# EAGLE schematic shield (EAGLE 9.3.0)
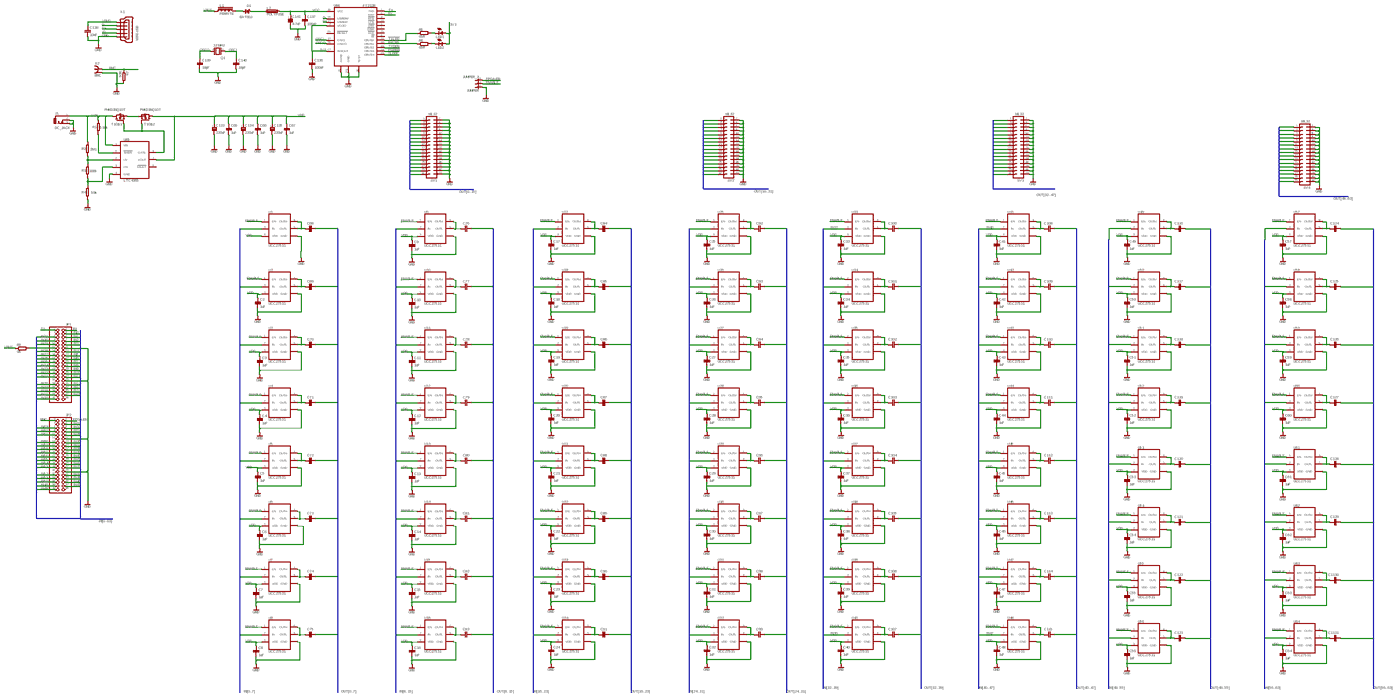
[diagram p0: schematic, sheet 1, overview]
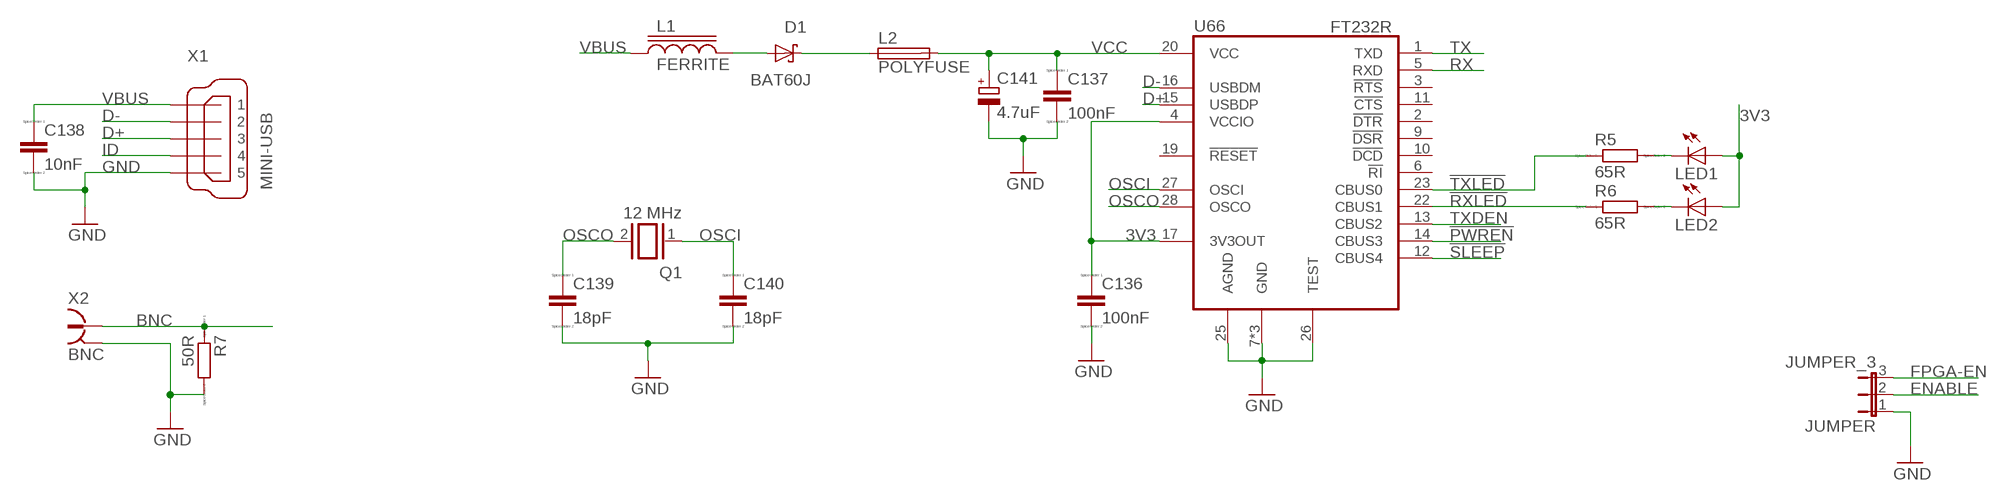
[diagram p1: schematic, sheet 1, part 1 of 4]
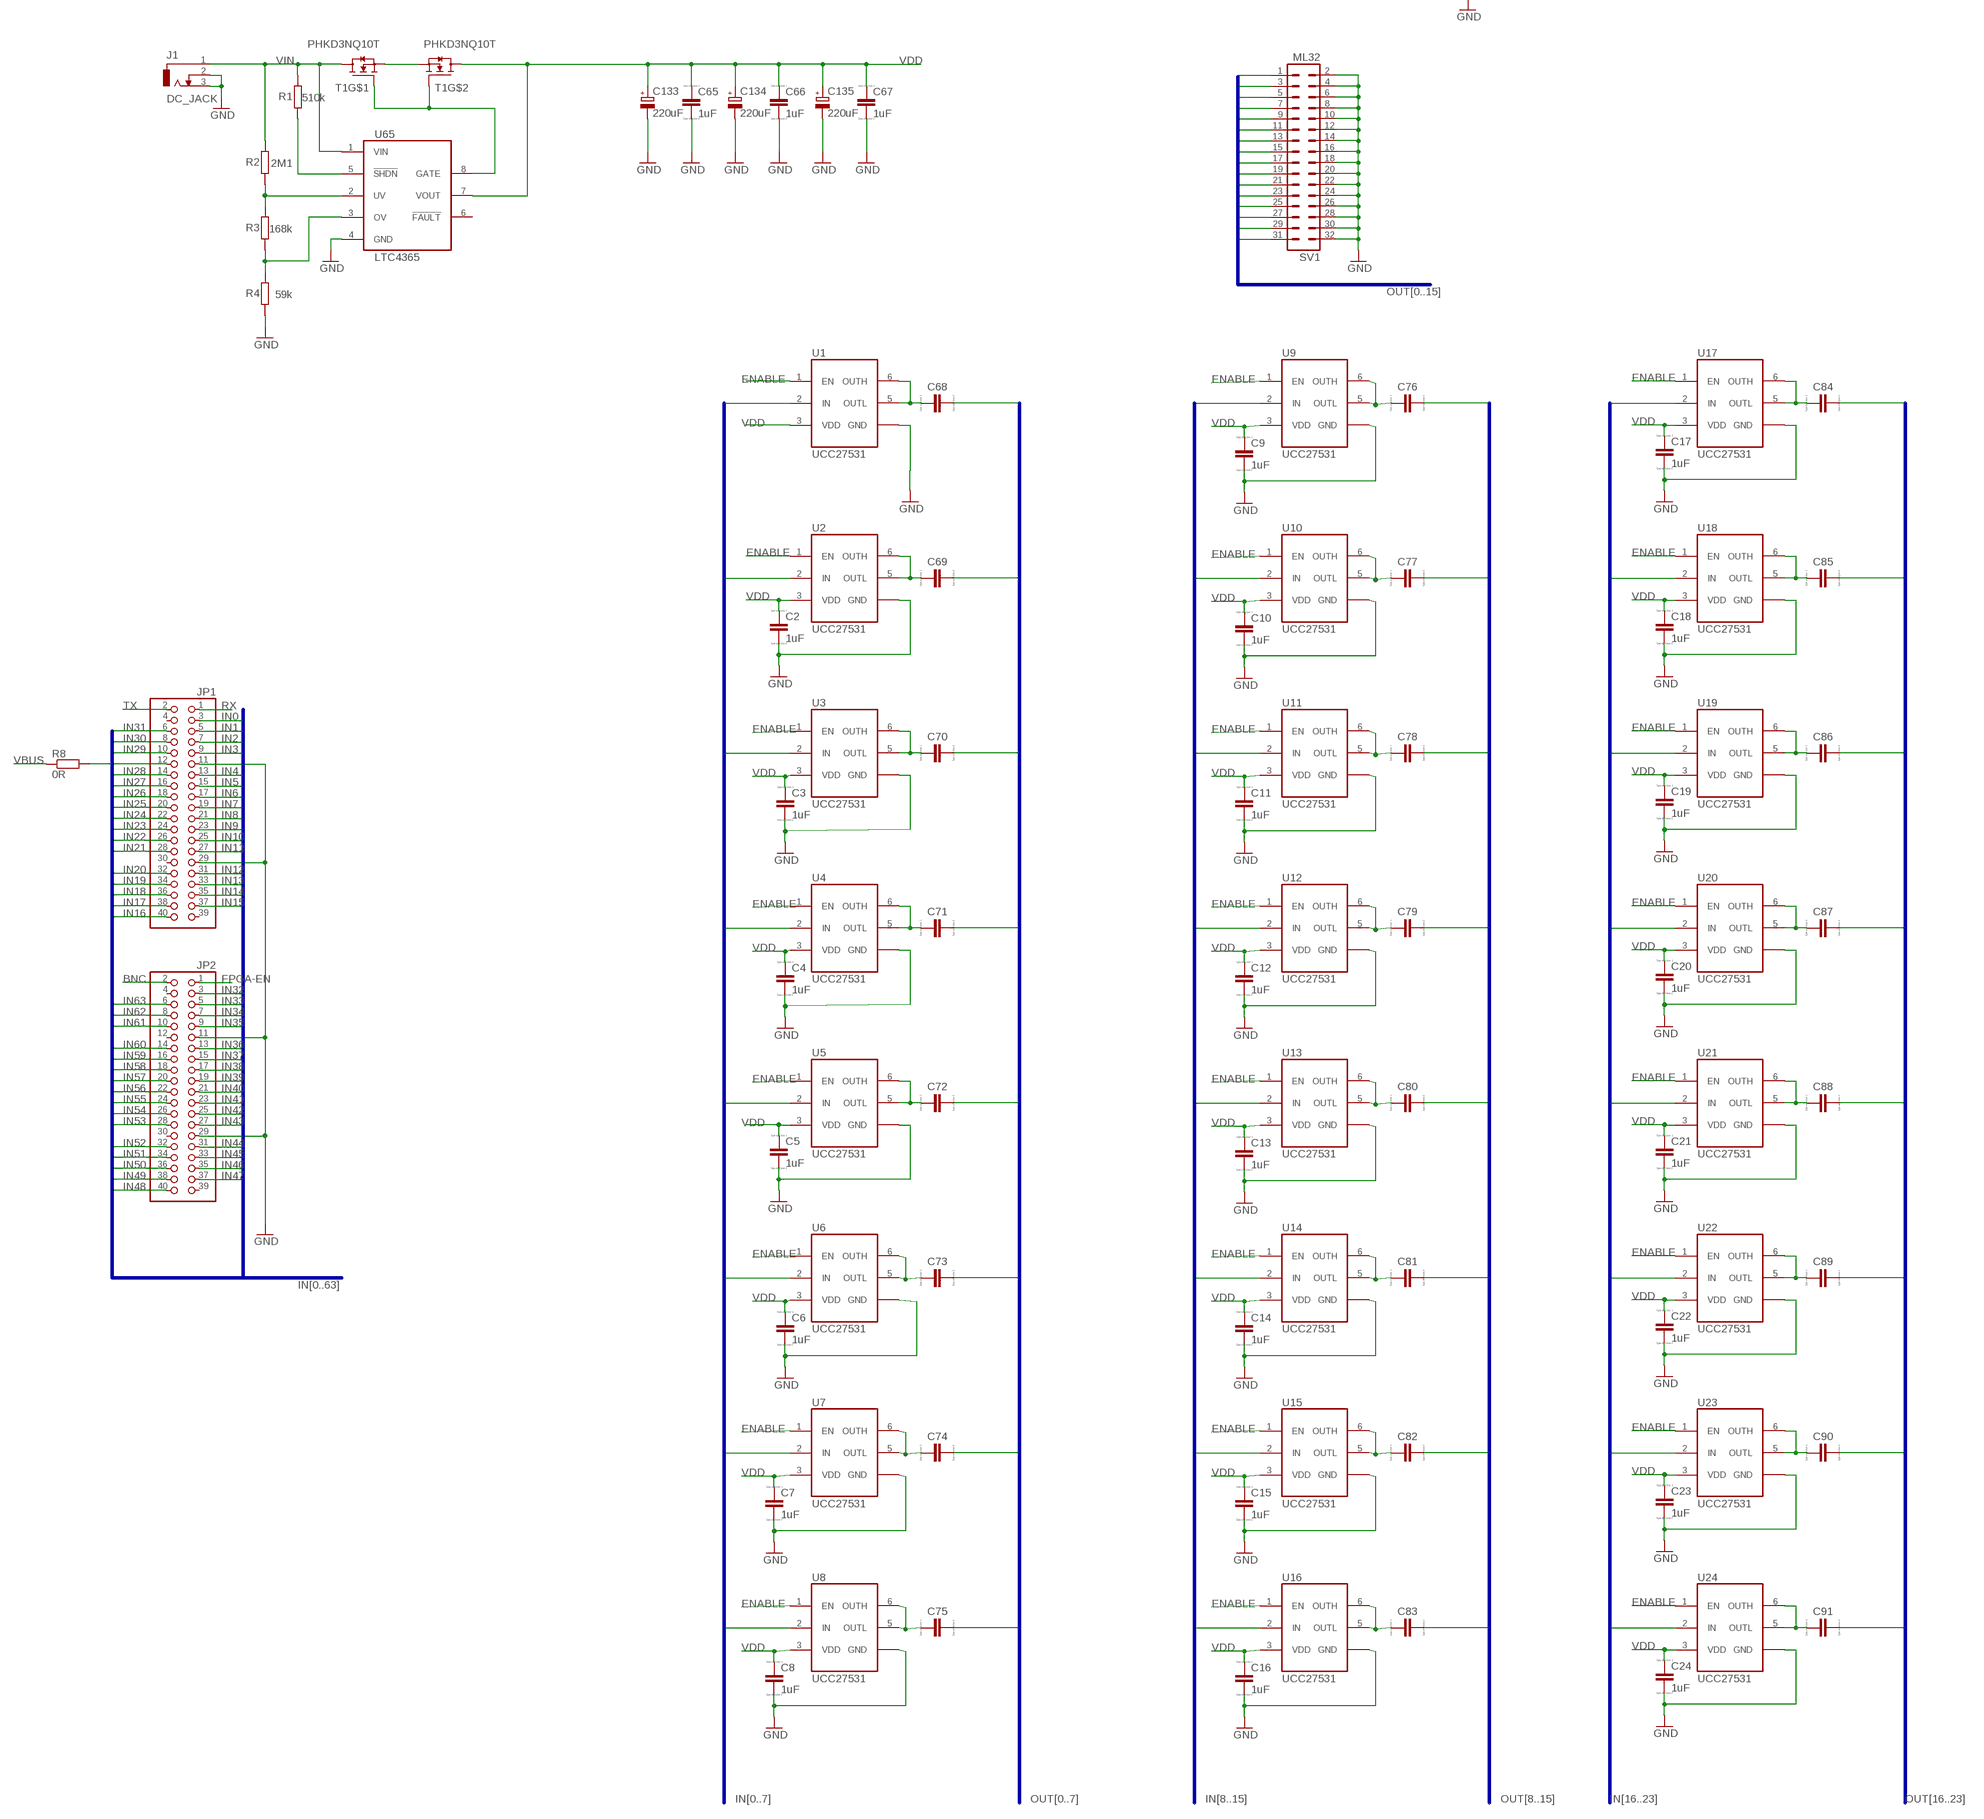
[diagram p2: schematic, sheet 1, part 2 of 4]
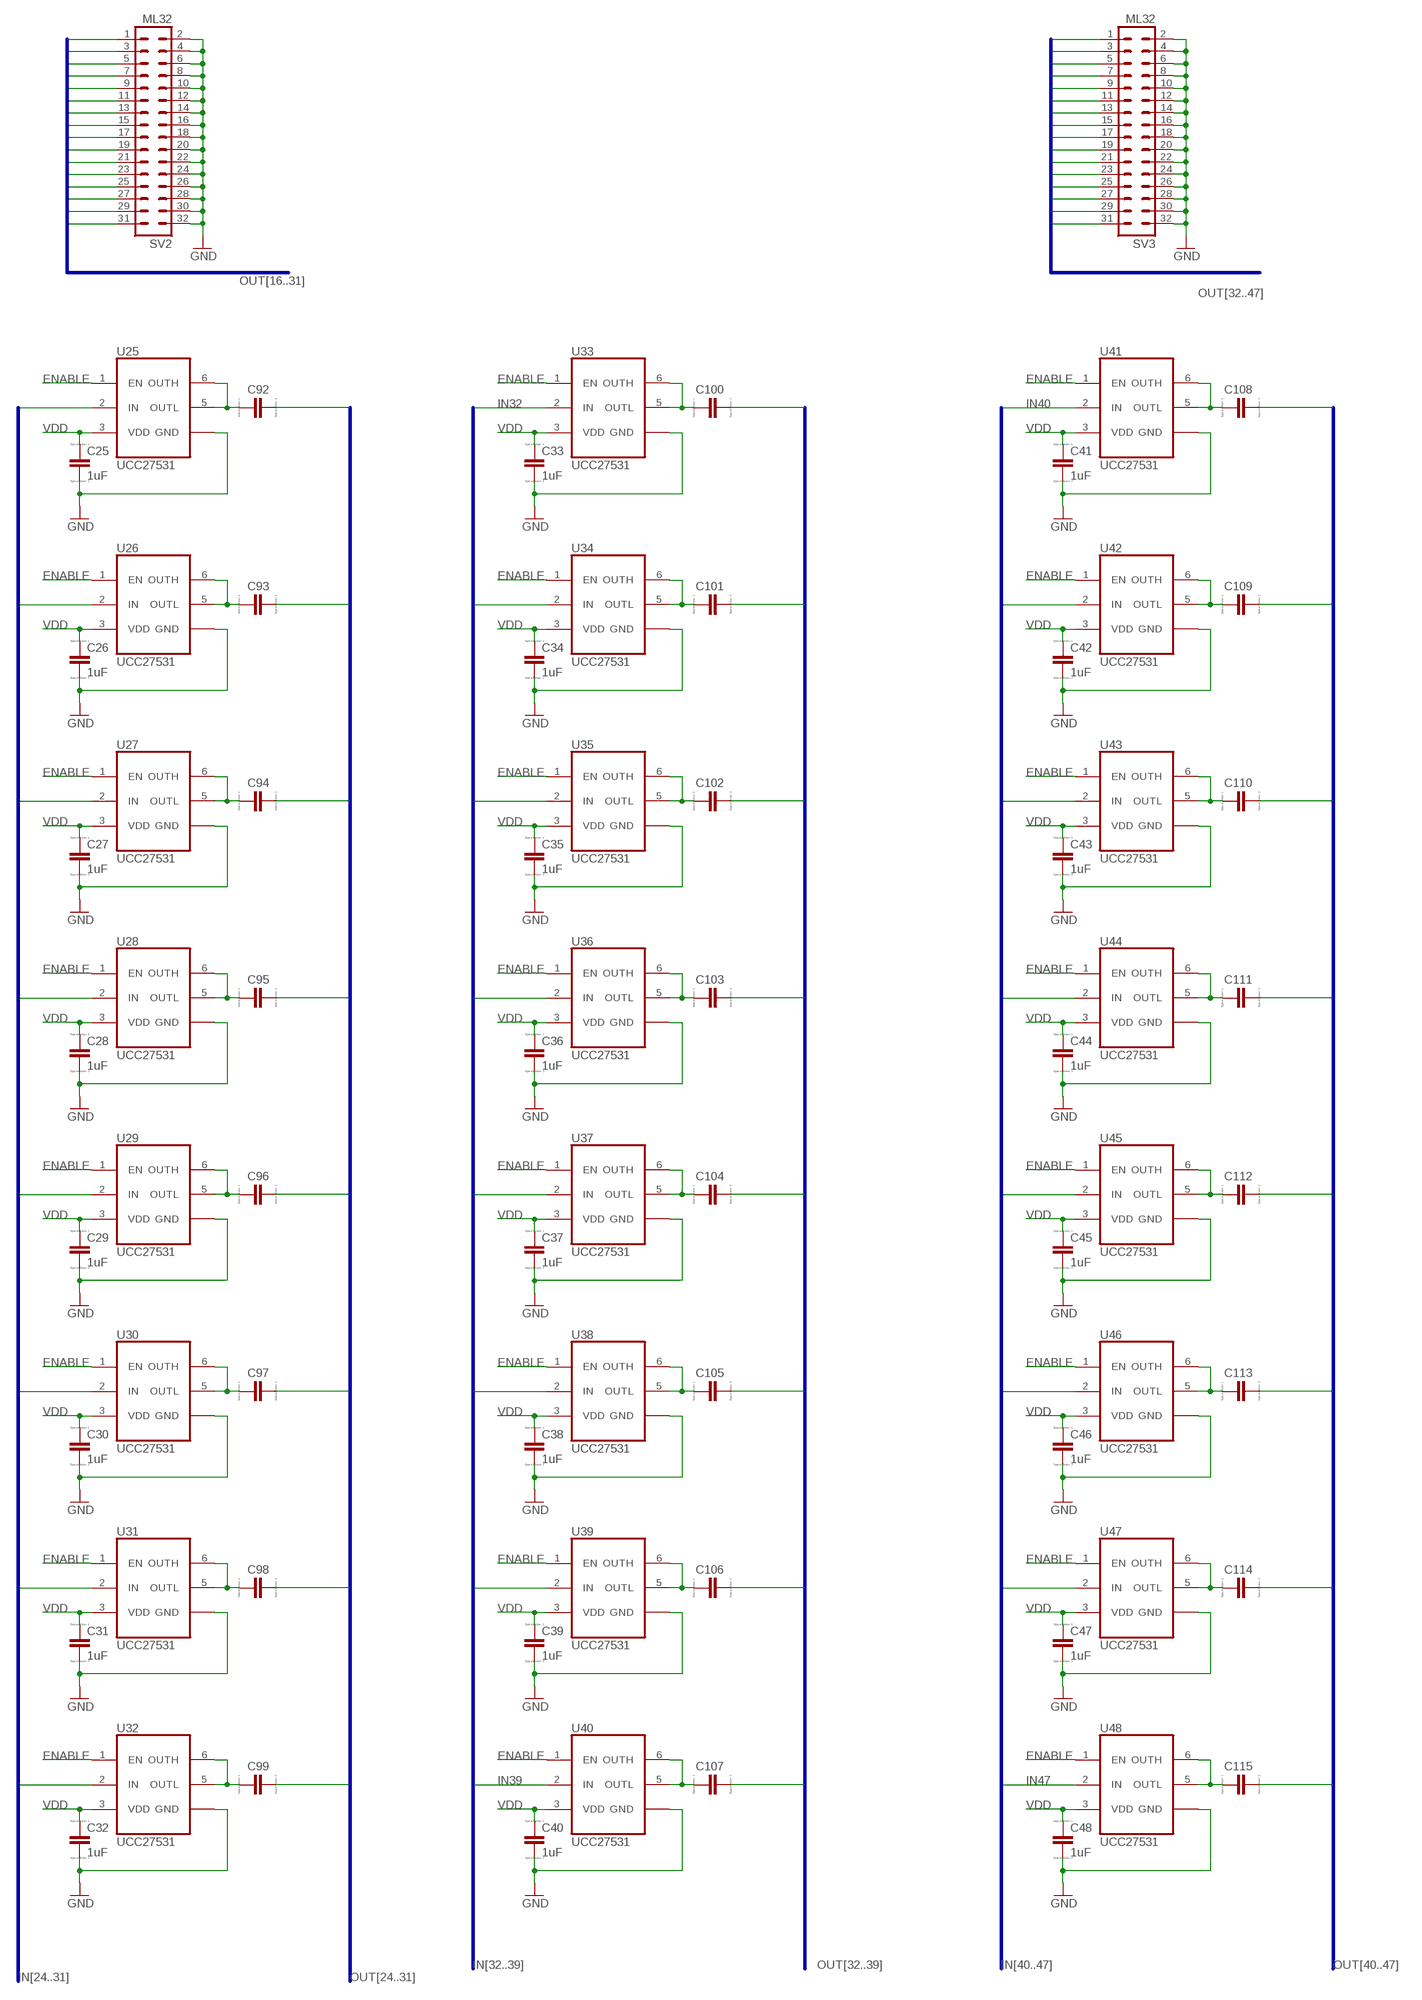
[diagram p3: schematic, sheet 1, part 3 of 4]
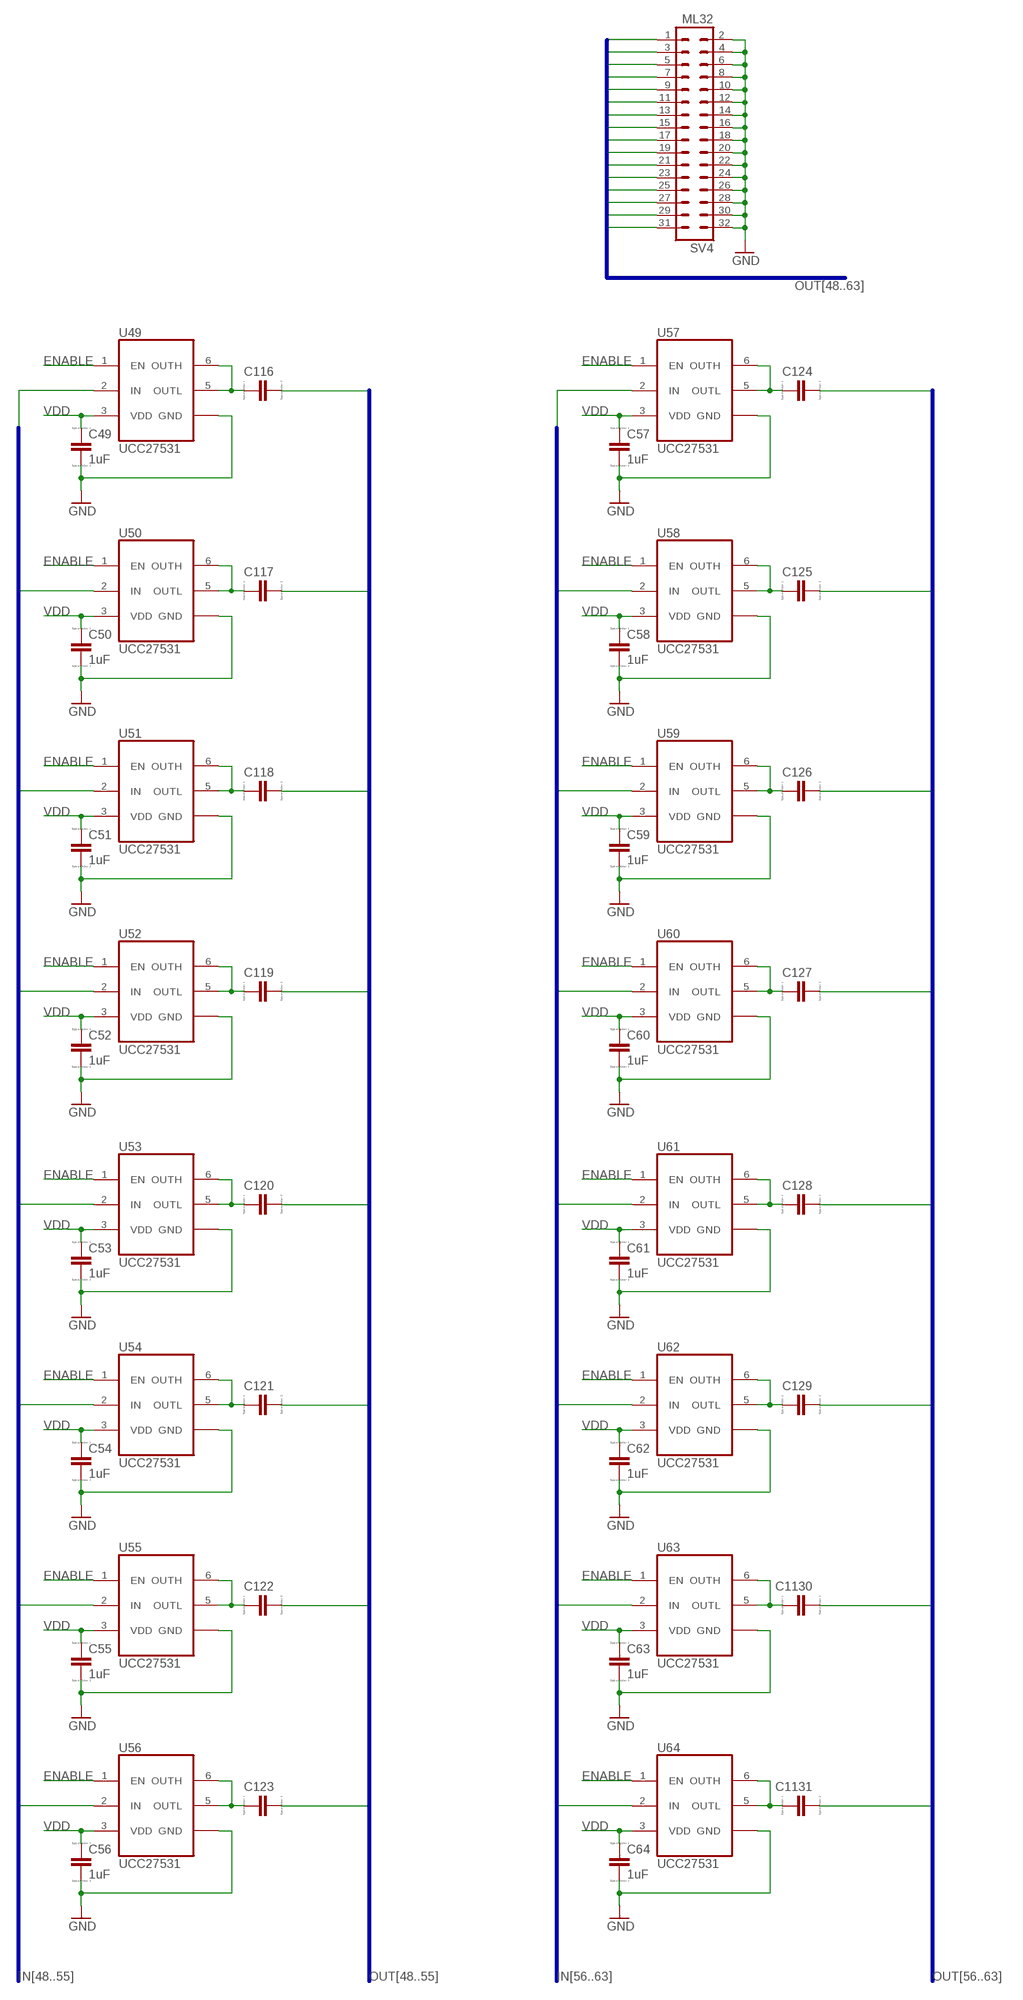
[diagram p4: schematic, sheet 1, part 4 of 4]

## Parts
C2  1uF  C  [C0805]
C3  1uF  C  [C0805]
C4  1uF  C  [C0805]
C5  1uF  C  [C0805]
C6  1uF  C  [C0805]
C7  1uF  C  [C0805]
C8  1uF  C  [C0805]
C9  1uF  C  [C0805]
C10  1uF  C  [C0805]
C11  1uF  C  [C0805]
C12  1uF  C  [C0805]
C13  1uF  C  [C0805]
C14  1uF  C  [C0805]
C15  1uF  C  [C0805]
C16  1uF  C  [C0805]
C17  1uF  C  [C0805]
C18  1uF  C  [C0805]
C19  1uF  C  [C0805]
C20  1uF  C  [C0805]
C21  1uF  C  [C0805]
C22  1uF  C  [C0805]
C23  1uF  C  [C0805]
C24  1uF  C  [C0805]
C25  1uF  C  [C0805]
C26  1uF  C  [C0805]
C27  1uF  C  [C0805]
C28  1uF  C  [C0805]
C29  1uF  C  [C0805]
C30  1uF  C  [C0805]
C31  1uF  C  [C0805]
C32  1uF  C  [C0805]
C33  1uF  C  [C0805]
C34  1uF  C  [C0805]
C35  1uF  C  [C0805]
C36  1uF  C  [C0805]
C37  1uF  C  [C0805]
C38  1uF  C  [C0805]
C39  1uF  C  [C0805]
C40  1uF  C  [C0805]
C41  1uF  C  [C0805]
C42  1uF  C  [C0805]
C43  1uF  C  [C0805]
C44  1uF  C  [C0805]
C45  1uF  C  [C0805]
C46  1uF  C  [C0805]
C47  1uF  C  [C0805]
C48  1uF  C  [C0805]
C49  1uF  C  [C0805]
C50  1uF  C  [C0805]
C51  1uF  C  [C0805]
C52  1uF  C  [C0805]
C53  1uF  C  [C0805]
C54  1uF  C  [C0805]
C55  1uF  C  [C0805]
C56  1uF  C  [C0805]
C57  1uF  C  [C0805]
C58  1uF  C  [C0805]
C59  1uF  C  [C0805]
C60  1uF  C  [C0805]
C61  1uF  C  [C0805]
C62  1uF  C  [C0805]
C63  1uF  C  [C0805]
C64  1uF  C  [C0805]
C65  1uF  C  [C0805]
C66  1uF  C  [C0805]
C67  1uF  C  [C0805]
C68  C  [C0805]
C69  C  [C0805]
C70  C  [C0805]
C71  C  [C0805]
C72  C  [C0805]
C73  C  [C0805]
C74  C  [C0805]
C75  C  [C0805]
C76  C  [C0805]
C77  C  [C0805]
C78  C  [C0805]
C79  C  [C0805]
C80  C  [C0805]
C81  C  [C0805]
C82  C  [C0805]
C83  C  [C0805]
C84  C  [C0805]
C85  C  [C0805]
C86  C  [C0805]
C87  C  [C0805]
C88  C  [C0805]
C89  C  [C0805]
C90  C  [C0805]
C91  C  [C0805]
C92  C  [C0805]
C93  C  [C0805]
C94  C  [C0805]
C95  C  [C0805]
C96  C  [C0805]
C97  C  [C0805]
C98  C  [C0805]
C99  C  [C0805]
C100  C  [C0805]
C101  C  [C0805]
C102  C  [C0805]
C103  C  [C0805]
C104  C  [C0805]
C105  C  [C0805]
C106  C  [C0805]
C107  C  [C0805]
C108  C  [C0805]
C109  C  [C0805]
C110  C  [C0805]
C111  C  [C0805]
C112  C  [C0805]
C113  C  [C0805]
C114  C  [C0805]
C115  C  [C0805]
C116  C  [C0805]
C117  C  [C0805]
C118  C  [C0805]
C119  C  [C0805]
C120  C  [C0805]
C121  C  [C0805]
C122  C  [C0805]
C123  C  [C0805]
C124  C  [C0805]
C125  C  [C0805]
C126  C  [C0805]
C127  C  [C0805]
C128  C  [C0805]
C129  C  [C0805]
C133  220uF  CPOL-EUE5-10.5  [E5-10,5]
C134  220uF  CPOL-EUE5-10.5  [E5-10,5]
C135  220uF  CPOL-EUE5-10.5  [E5-10,5]
C136  100nF  C  [C0805]
C137  100nF  C  [C0805]
C138  10nF  C  [C0805]
C139  18pF  CC0603  [C0603]
C140  18pF  CC0603  [C0603]
C141  4.7uF  CPOL-EUE2-5  [E2-5]
C1130  C  [C0805]
C1131  C  [C0805]
D1  BAT60J  [SOD323_ST]
J1  DC_JACK  [DCJ0202]
JP1  PINHD-2X20  [2X20]
JP2  PINHD-2X20  [2X20]
JUMPER  JUMPER_3  [JP2]
L1  FERRITE  [SML0805]
L2  POLYFUSE  [SML0805]
LED1  LEDSML1206  [SML1206]
LED2  LEDSML1206  [SML1206]
Q1  12 MHz  XTAL/S  [QS]
R1  510k  R-EU_R0805  [R0805]
R2  2M1  R-EU_R0805  [R0805]
R3  168k  R-EU_R0805  [R0805]
R4  59k  R-EU_R0805  [R0805]
R5  65R  R  [R0805]
R6  65R  R  [R0805]
R7  50R  RR0603  [R0603]
R8  0R  R-EU_R0805  [R0805]
SV1  ML32  [ML32]
SV2  ML32  [ML32]
SV3  ML32  [ML32]
SV4  ML32  [ML32]
T1  PHKD3NQ10T  [SO8]
U1  UCC27531  [DBV_R-PDSO-G6]
U2  UCC27531  [DBV_R-PDSO-G6]
U3  UCC27531  [DBV_R-PDSO-G6]
U4  UCC27531  [DBV_R-PDSO-G6]
U5  UCC27531  [DBV_R-PDSO-G6]
U6  UCC27531  [DBV_R-PDSO-G6]
U7  UCC27531  [DBV_R-PDSO-G6]
U8  UCC27531  [DBV_R-PDSO-G6]
U9  UCC27531  [DBV_R-PDSO-G6]
U10  UCC27531  [DBV_R-PDSO-G6]
U11  UCC27531  [DBV_R-PDSO-G6]
U12  UCC27531  [DBV_R-PDSO-G6]
U13  UCC27531  [DBV_R-PDSO-G6]
U14  UCC27531  [DBV_R-PDSO-G6]
U15  UCC27531  [DBV_R-PDSO-G6]
U16  UCC27531  [DBV_R-PDSO-G6]
U17  UCC27531  [DBV_R-PDSO-G6]
U18  UCC27531  [DBV_R-PDSO-G6]
U19  UCC27531  [DBV_R-PDSO-G6]
U20  UCC27531  [DBV_R-PDSO-G6]
U21  UCC27531  [DBV_R-PDSO-G6]
U22  UCC27531  [DBV_R-PDSO-G6]
U23  UCC27531  [DBV_R-PDSO-G6]
U24  UCC27531  [DBV_R-PDSO-G6]
U25  UCC27531  [DBV_R-PDSO-G6]
U26  UCC27531  [DBV_R-PDSO-G6]
U27  UCC27531  [DBV_R-PDSO-G6]
U28  UCC27531  [DBV_R-PDSO-G6]
U29  UCC27531  [DBV_R-PDSO-G6]
U30  UCC27531  [DBV_R-PDSO-G6]
U31  UCC27531  [DBV_R-PDSO-G6]
U32  UCC27531  [DBV_R-PDSO-G6]
U33  UCC27531  [DBV_R-PDSO-G6]
U34  UCC27531  [DBV_R-PDSO-G6]
U35  UCC27531  [DBV_R-PDSO-G6]
U36  UCC27531  [DBV_R-PDSO-G6]
U37  UCC27531  [DBV_R-PDSO-G6]
U38  UCC27531  [DBV_R-PDSO-G6]
U39  UCC27531  [DBV_R-PDSO-G6]
U40  UCC27531  [DBV_R-PDSO-G6]
U41  UCC27531  [DBV_R-PDSO-G6]
U42  UCC27531  [DBV_R-PDSO-G6]
U43  UCC27531  [DBV_R-PDSO-G6]
U44  UCC27531  [DBV_R-PDSO-G6]
U45  UCC27531  [DBV_R-PDSO-G6]
U46  UCC27531  [DBV_R-PDSO-G6]
U47  UCC27531  [DBV_R-PDSO-G6]
U48  UCC27531  [DBV_R-PDSO-G6]
U49  UCC27531  [DBV_R-PDSO-G6]
U50  UCC27531  [DBV_R-PDSO-G6]
U51  UCC27531  [DBV_R-PDSO-G6]
U52  UCC27531  [DBV_R-PDSO-G6]
U53  UCC27531  [DBV_R-PDSO-G6]
U54  UCC27531  [DBV_R-PDSO-G6]
U55  UCC27531  [DBV_R-PDSO-G6]
U56  UCC27531  [DBV_R-PDSO-G6]
U57  UCC27531  [DBV_R-PDSO-G6]
U58  UCC27531  [DBV_R-PDSO-G6]
U59  UCC27531  [DBV_R-PDSO-G6]
U60  UCC27531  [DBV_R-PDSO-G6]
U61  UCC27531  [DBV_R-PDSO-G6]
U62  UCC27531  [DBV_R-PDSO-G6]
U63  UCC27531  [DBV_R-PDSO-G6]
U64  UCC27531  [DBV_R-PDSO-G6]
U65  LTC4365  [TSOT23-8]
U66  FT232R  [SSOP28]
X1  MINI-USB  MINI_USB  [32005-201]
X2  BNC  [BNC_CUSTOM]

## Nets
3V3: C136.1 LED1.A LED2.A U66.4(VCCIO) U66.17(3V3OUT)
!PWREN!: U66.14(CBUS3)
!RXLED!: R6.1 U66.22(CBUS1)
!SLEEP!: U66.12(CBUS4)
!TXLED!: R5.1 U66.23(CBUS0)
BNC: JP2.2 R7.1 X2.1
D+: U66.15(USBDP) X1.3
D-: U66.16(USBDM) X1.2
ENABLE: JUMPER.2 U1.1(EN) U2.1(EN) U3.1(EN) U4.1(EN) U5.1(EN) U6.1(EN) U7.1(EN) U8.1(EN) U9.1(EN) U10.1(EN) U11.1(EN) U12.1(EN) U13.1(EN) U14.1(EN) U15.1(EN) U16.1(EN) U17.1(EN) U18.1(EN) U19.1(EN) U20.1(EN) U21.1(EN) U22.1(EN) U23.1(EN) U24.1(EN) U25.1(EN) U26.1(EN) U27.1(EN) U28.1(EN) U29.1(EN) U30.1(EN) U31.1(EN) U32.1(EN) U33.1(EN) U34.1(EN) U35.1(EN) U36.1(EN) U37.1(EN) U38.1(EN) U39.1(EN) U40.1(EN) U41.1(EN) U42.1(EN) U43.1(EN) U44.1(EN) U45.1(EN) U46.1(EN) U47.1(EN) U48.1(EN) U49.1(EN) U50.1(EN) U51.1(EN) U52.1(EN) U53.1(EN) U54.1(EN) U55.1(EN) U56.1(EN) U57.1(EN) U58.1(EN) U59.1(EN) U60.1(EN) U61.1(EN) U62.1(EN) U63.1(EN) U64.1(EN)
FPGA-EN: JP2.1 JUMPER.3
GND: C2.2 C3.2 C4.2 C5.2 C6.2 C7.2 C8.2 C9.2 C10.2 C11.2 C12.2 C13.2 C14.2 C15.2 C16.2 C17.2 C18.2 C19.2 C20.2 C21.2 C22.2 C23.2 C24.2 C25.2 C26.2 C27.2 C28.2 C29.2 C30.2 C31.2 C32.2 C33.2 C34.2 C35.2 C36.2 C37.2 C38.2 C39.2 C40.2 C41.2 C42.2 C43.2 C44.2 C45.2 C46.2 C47.2 C48.2 C49.2 C50.2 C51.2 C52.2 C53.2 C54.2 C55.2 C56.2 C57.2 C58.2 C59.2 C60.2 C61.2 C62.2 C63.2 C64.2 C65.2 C66.2 C67.2 C133.- C134.- C135.- C136.2 C137.2 C138.2 C139.2 C140.2 C141.- J1.2 J1.3 JP1.11 JP1.29 JP2.11 JP2.29 JUMPER.1 R4.1 R7.2 SV1.2 SV1.4 SV1.6 SV1.8 SV1.10 SV1.12 SV1.14 SV1.16 SV1.18 SV1.20 SV1.22 SV1.24 SV1.26 SV1.28 SV1.30 SV1.32 SV2.2 SV2.4 SV2.6 SV2.8 SV2.10 SV2.12 SV2.14 SV2.16 SV2.18 SV2.20 SV2.22 SV2.24 SV2.26 SV2.28 SV2.30 SV2.32 SV3.2 SV3.4 SV3.6 SV3.8 SV3.10 SV3.12 SV3.14 SV3.16 SV3.18 SV3.20 SV3.22 SV3.24 SV3.26 SV3.28 SV3.30 SV3.32 SV4.2 SV4.4 SV4.6 SV4.8 SV4.10 SV4.12 SV4.14 SV4.16 SV4.18 SV4.20 SV4.22 SV4.24 SV4.26 SV4.28 SV4.30 SV4.32 U1.4(GND) U2.4(GND) U3.4(GND) U4.4(GND) U5.4(GND) U6.4(GND) U7.4(GND) U8.4(GND) U9.4(GND) U10.4(GND) U11.4(GND) U12.4(GND) U13.4(GND) U14.4(GND) U15.4(GND) U16.4(GND) U17.4(GND) U18.4(GND) U19.4(GND) U20.4(GND) U21.4(GND) U22.4(GND) U23.4(GND) U24.4(GND) U25.4(GND) U26.4(GND) U27.4(GND) U28.4(GND) U29.4(GND) U30.4(GND) U31.4(GND) U32.4(GND) U33.4(GND) U34.4(GND) U35.4(GND) U36.4(GND) U37.4(GND) U38.4(GND) U39.4(GND) U40.4(GND) U41.4(GND) U42.4(GND) U43.4(GND) U44.4(GND) U45.4(GND) U46.4(GND) U47.4(GND) U48.4(GND) U49.4(GND) U50.4(GND) U51.4(GND) U52.4(GND) U53.4(GND) U54.4(GND) U55.4(GND) U56.4(GND) U57.4(GND) U58.4(GND) U59.4(GND) U60.4(GND) U61.4(GND) U62.4(GND) U63.4(GND) U64.4(GND) U65.4(GND) U66.7(GND) U66.18(GND) U66.21(GND) U66.25(AGND) U66.26(TEST) X1.5 X2.2
ID: X1.4
IN0: JP1.3 U1.2(IN)
IN1: JP1.5 U2.2(IN)
IN2: JP1.7 U3.2(IN)
IN3: JP1.9 U4.2(IN)
IN4: JP1.13 U5.2(IN)
IN5: JP1.15 U6.2(IN)
IN6: JP1.17 U7.2(IN)
IN7: JP1.19 U8.2(IN)
IN8: JP1.21 U9.2(IN)
IN9: JP1.23 U10.2(IN)
IN10: JP1.25 U11.2(IN)
IN11: JP1.27 U12.2(IN)
IN12: JP1.31 U13.2(IN)
IN13: JP1.33 U14.2(IN)
IN14: JP1.35 U15.2(IN)
IN15: JP1.37 U16.2(IN)
IN16: JP1.40 U17.2(IN)
IN17: JP1.38 U18.2(IN)
IN18: JP1.36 U19.2(IN)
IN19: JP1.34 U20.2(IN)
IN20: JP1.32 U21.2(IN)
IN21: JP1.28 U22.2(IN)
IN22: JP1.26 U23.2(IN)
IN23: JP1.24 U24.2(IN)
IN24: JP1.22 U25.2(IN)
IN25: JP1.20 U26.2(IN)
IN26: JP1.18 U27.2(IN)
IN27: JP1.16 U28.2(IN)
IN28: JP1.14 U29.2(IN)
IN29: JP1.10 U30.2(IN)
IN30: JP1.8 U31.2(IN)
IN31: JP1.6 U32.2(IN)
IN32: JP2.3 U33.2(IN)
IN33: JP2.5 U34.2(IN)
IN34: JP2.7 U35.2(IN)
IN35: JP2.9 U36.2(IN)
IN36: JP2.13 U37.2(IN)
IN37: JP2.15 U38.2(IN)
IN38: JP2.17 U39.2(IN)
IN39: JP2.19 U40.2(IN)
IN40: JP2.21 U41.2(IN)
IN41: JP2.23 U42.2(IN)
IN42: JP2.25 U43.2(IN)
IN43: JP2.27 U44.2(IN)
IN44: JP2.31 U45.2(IN)
IN45: JP2.33 U46.2(IN)
IN46: JP2.35 U47.2(IN)
IN47: JP2.37 U48.2(IN)
IN48: JP2.40 U49.2(IN)
IN49: JP2.38 U50.2(IN)
IN50: JP2.36 U51.2(IN)
IN51: JP2.34 U52.2(IN)
IN52: JP2.32 U53.2(IN)
IN53: JP2.28 U54.2(IN)
IN54: JP2.26 U55.2(IN)
IN55: JP2.24 U56.2(IN)
IN56: JP2.22 U57.2(IN)
IN57: JP2.20 U58.2(IN)
IN58: JP2.18 U59.2(IN)
IN59: JP2.16 U60.2(IN)
IN60: JP2.14 U61.2(IN)
IN61: JP2.10 U62.2(IN)
IN62: JP2.8 U63.2(IN)
IN63: JP2.6 U64.2(IN)
N$1: JP1.12 R8.2
N$2: D1.C L2.A
N$3: D1.A L1.C
N$4: R1.1 U65.5(!SHDN!)
N$6: R2.1 R3.2 U65.2(UV)
N$7: R3.1 R4.2 U65.3(OV)
N$9: T1.1(S) T1.3(S)
N$10: T1.2(G) T1.4(G) U65.8(GATE)
N$12: LED1.C R5.2
N$13: LED2.C R6.2
N$26: C100.1 U33.5(OUTL) U33.6(OUTH)
N$27: C101.1 U34.5(OUTL) U34.6(OUTH)
N$28: C102.1 U35.5(OUTL) U35.6(OUTH)
N$29: C103.1 U36.5(OUTL) U36.6(OUTH)
N$30: C104.1 U37.5(OUTL) U37.6(OUTH)
N$31: C105.1 U38.5(OUTL) U38.6(OUTH)
N$32: C106.1 U39.5(OUTL) U39.6(OUTH)
N$33: C107.1 U40.5(OUTL) U40.6(OUTH)
N$34: C108.1 U41.5(OUTL) U41.6(OUTH)
N$35: C109.1 U42.5(OUTL) U42.6(OUTH)
N$36: C110.1 U43.5(OUTL) U43.6(OUTH)
N$37: C111.1 U44.5(OUTL) U44.6(OUTH)
N$38: C112.1 U45.5(OUTL) U45.6(OUTH)
N$39: C113.1 U46.5(OUTL) U46.6(OUTH)
N$40: C114.1 U47.5(OUTL) U47.6(OUTH)
N$41: C115.1 U48.5(OUTL) U48.6(OUTH)
N$42: C84.1 U17.5(OUTL) U17.6(OUTH)
N$43: C85.1 U18.5(OUTL) U18.6(OUTH)
N$44: C86.1 U19.5(OUTL) U19.6(OUTH)
N$45: C87.1 U20.5(OUTL) U20.6(OUTH)
N$46: C88.1 U21.5(OUTL) U21.6(OUTH)
N$47: C89.1 U22.5(OUTL) U22.6(OUTH)
N$48: C90.1 U23.5(OUTL) U23.6(OUTH)
N$49: C91.1 U24.5(OUTL) U24.6(OUTH)
N$50: C92.1 U25.5(OUTL) U25.6(OUTH)
N$51: C93.1 U26.5(OUTL) U26.6(OUTH)
N$52: C94.1 U27.5(OUTL) U27.6(OUTH)
N$53: C95.1 U28.5(OUTL) U28.6(OUTH)
N$54: C96.1 U29.5(OUTL) U29.6(OUTH)
N$55: C97.1 U30.5(OUTL) U30.6(OUTH)
N$56: C98.1 U31.5(OUTL) U31.6(OUTH)
N$57: C99.1 U32.5(OUTL) U32.6(OUTH)
N$58: C68.1 U1.5(OUTL) U1.6(OUTH)
N$59: C69.1 U2.5(OUTL) U2.6(OUTH)
N$60: C70.1 U3.5(OUTL) U3.6(OUTH)
N$61: C71.1 U4.5(OUTL) U4.6(OUTH)
N$62: C72.1 U5.5(OUTL) U5.6(OUTH)
N$63: C73.1 U6.5(OUTL) U6.6(OUTH)
N$64: C74.1 U7.5(OUTL) U7.6(OUTH)
N$65: C75.1 U8.5(OUTL) U8.6(OUTH)
N$66: C76.1 U9.5(OUTL) U9.6(OUTH)
N$67: C77.1 U10.5(OUTL) U10.6(OUTH)
N$68: C78.1 U11.5(OUTL) U11.6(OUTH)
N$69: C79.1 U12.5(OUTL) U12.6(OUTH)
N$70: C80.1 U13.5(OUTL) U13.6(OUTH)
N$71: C81.1 U14.5(OUTL) U14.6(OUTH)
N$72: C82.1 U15.5(OUTL) U15.6(OUTH)
N$73: C83.1 U16.5(OUTL) U16.6(OUTH)
N$146: C116.1 U49.5(OUTL) U49.6(OUTH)
N$149: C117.1 U50.5(OUTL) U50.6(OUTH)
N$152: C118.1 U51.5(OUTL) U51.6(OUTH)
N$155: C119.1 U52.5(OUTL) U52.6(OUTH)
N$158: C120.1 U53.5(OUTL) U53.6(OUTH)
N$161: C121.1 U54.5(OUTL) U54.6(OUTH)
N$164: C122.1 U55.5(OUTL) U55.6(OUTH)
N$167: C123.1 U56.5(OUTL) U56.6(OUTH)
N$170: C124.1 U57.5(OUTL) U57.6(OUTH)
N$173: C125.1 U58.5(OUTL) U58.6(OUTH)
N$176: C126.1 U59.5(OUTL) U59.6(OUTH)
N$179: C127.1 U60.5(OUTL) U60.6(OUTH)
N$182: C128.1 U61.5(OUTL) U61.6(OUTH)
N$185: C129.1 U62.5(OUTL) U62.6(OUTH)
N$188: C1130.1 U63.5(OUTL) U63.6(OUTH)
N$191: C1131.1 U64.5(OUTL) U64.6(OUTH)
OSCI: C140.1 Q1.1 U66.27(OSCI)
OSCO: C139.1 Q1.2 U66.28(OSCO)
OUT0: C68.2 SV1.1
OUT1: C69.2 SV1.3
OUT2: C70.2 SV1.5
OUT3: C71.2 SV1.7
OUT4: C72.2 SV1.9
OUT5: C73.2 SV1.11
OUT6: C74.2 SV1.13
OUT7: C75.2 SV1.15
OUT8: C76.2 SV1.17
OUT9: C77.2 SV1.19
OUT10: C78.2 SV1.21
OUT11: C79.2 SV1.23
OUT12: C80.2 SV1.25
OUT13: C81.2 SV1.27
OUT14: C82.2 SV1.29
OUT15: C83.2 SV1.31
OUT16: C84.2 SV2.1
OUT17: C85.2 SV2.3
OUT18: C86.2 SV2.5
OUT19: C87.2 SV2.7
OUT20: C88.2 SV2.9
OUT21: C89.2 SV2.11
OUT22: C90.2 SV2.13
OUT23: C91.2 SV2.15
OUT24: C92.2 SV2.17
OUT25: C93.2 SV2.19
OUT26: C94.2 SV2.21
OUT27: C95.2 SV2.23
OUT28: C96.2 SV2.25
OUT29: C97.2 SV2.27
OUT30: C98.2 SV2.29
OUT31: C99.2 SV2.31
OUT32: C100.2 SV3.1
OUT33: C101.2 SV3.3
OUT34: C102.2 SV3.5
OUT35: C103.2 SV3.7
OUT36: C104.2 SV3.9
OUT37: C105.2 SV3.11
OUT38: C106.2 SV3.13
OUT39: C107.2 SV3.15
OUT40: C108.2 SV3.17
OUT41: C109.2 SV3.19
OUT42: C110.2 SV3.21
OUT43: C111.2 SV3.23
OUT44: C112.2 SV3.25
OUT45: C113.2 SV3.27
OUT46: C114.2 SV3.29
OUT47: C115.2 SV3.31
OUT48: C116.2 SV4.1
OUT49: C117.2 SV4.3
OUT50: C118.2 SV4.5
OUT51: C119.2 SV4.7
OUT52: C120.2 SV4.9
OUT53: C121.2 SV4.11
OUT54: C122.2 SV4.13
OUT55: C123.2 SV4.15
OUT56: C124.2 SV4.17
OUT57: C125.2 SV4.19
OUT58: C126.2 SV4.21
OUT59: C127.2 SV4.23
OUT60: C128.2 SV4.25
OUT61: C129.2 SV4.27
OUT62: C1130.2 SV4.29
OUT63: C1131.2 SV4.31
RX: JP1.1 U66.5(RXD)
TX: JP1.2 U66.1(TXD)
TXDEN: U66.13(CBUS2)
VBUS: C138.1 L1.A R8.1 X1.1
VCC: C137.1 C141.+ L2.C U66.20(VCC)
VDD: C2.1 C3.1 C4.1 C5.1 C6.1 C7.1 C8.1 C9.1 C10.1 C11.1 C12.1 C13.1 C14.1 C15.1 C16.1 C17.1 C18.1 C19.1 C20.1 C21.1 C22.1 C23.1 C24.1 C25.1 C26.1 C27.1 C28.1 C29.1 C30.1 C31.1 C32.1 C33.1 C34.1 C35.1 C36.1 C37.1 C38.1 C39.1 C40.1 C41.1 C42.1 C43.1 C44.1 C45.1 C46.1 C47.1 C48.1 C49.1 C50.1 C51.1 C52.1 C53.1 C54.1 C55.1 C56.1 C57.1 C58.1 C59.1 C60.1 C61.1 C62.1 C63.1 C64.1 C65.1 C66.1 C67.1 C133.+ C134.+ C135.+ T1.5(D) T1.6(D) U1.3(VDD) U2.3(VDD) U3.3(VDD) U4.3(VDD) U5.3(VDD) U6.3(VDD) U7.3(VDD) U8.3(VDD) U9.3(VDD) U10.3(VDD) U11.3(VDD) U12.3(VDD) U13.3(VDD) U14.3(VDD) U15.3(VDD) U16.3(VDD) U17.3(VDD) U18.3(VDD) U19.3(VDD) U20.3(VDD) U21.3(VDD) U22.3(VDD) U23.3(VDD) U24.3(VDD) U25.3(VDD) U26.3(VDD) U27.3(VDD) U28.3(VDD) U29.3(VDD) U30.3(VDD) U31.3(VDD) U32.3(VDD) U33.3(VDD) U34.3(VDD) U35.3(VDD) U36.3(VDD) U37.3(VDD) U38.3(VDD) U39.3(VDD) U40.3(VDD) U41.3(VDD) U42.3(VDD) U43.3(VDD) U44.3(VDD) U45.3(VDD) U46.3(VDD) U47.3(VDD) U48.3(VDD) U49.3(VDD) U50.3(VDD) U51.3(VDD) U52.3(VDD) U53.3(VDD) U54.3(VDD) U55.3(VDD) U56.3(VDD) U57.3(VDD) U58.3(VDD) U59.3(VDD) U60.3(VDD) U61.3(VDD) U62.3(VDD) U63.3(VDD) U64.3(VDD) U65.7(VOUT)
VIN: J1.1 R1.2 R2.2 T1.7(D) T1.8(D) U65.1(VIN)
Unconnected: JP1.4 JP1.30 JP1.39 JP2.4 JP2.12 JP2.30 JP2.39 U65.6(!FAULT!) U66.2(!DTR!) U66.3(!RTS!) U66.6(!RI!) U66.8(NC) U66.9(!DSR!) U66.10(!DCD!) U66.11(!CTS!) U66.19(!RESET!) U66.24(NC2)

## Buses
IN[0..63]
OUT[48..63]
OUT[32..47]
IN[32..39]
OUT[32..39]
IN[40..47]
OUT[40..47]
OUT[16..31]
IN[16..23]
OUT[16..23]
IN[24..31]
OUT[24..31]
OUT[0..15]
IN[0..7]
OUT[0..7]
IN[8..15]
OUT[8..15]
IN[48..55]
OUT[48..55]
IN[56..63]
OUT[56..63]

## Library data of the parts
C2-C129 C136-C140 C1130 C1131 = eagle-ltspice:C: CAPACITOR, European symbol; SPICEMODEL: NONE; SPICEPREFIX: C
C133-C135 C141 = rcl:CPOL-EU: POLARIZED CAPACITOR, European symbol; SPICEPREFIX: C
D1 = diode:BAT60J: Schottky barrier diode Source: www.st.com, BAT60J.pdf
J1 = shieldLibrary:DC_JACK: DC Barrel Power Jack 5.5/2.1 mm
JP1 JP2 = pinhead:PINHD-2X20: PIN HEADER
JUMPER = shieldLibrary:JUMPER_3: 3-PIN HEADER Jumper
L1 = shieldLibrary:FERRITE: Ferrite bead SMD0805 package
L2 = shieldLibrary:POLYFUSE: PTC Resettable fuse SMD0805 Package
LED1 LED2 = led:LED: LED OSRAM: - CHIPLED LG R971, LG N971, LY N971, LG Q971, LY Q971, LO R971, LY R971 LH N974, LH R974 LS Q976, LO Q976, LY Q976 LO Q996 - Hyper CHIPLED LW Q18S LB Q993, LB Q99A, LB R99A - SideLED LS A670, LO A670, LY A670, LG A670, LP A670 LB A673, LV A673, LT A673, LW A673 LH A674 LY A675 LS A676, LA A676, LO A676, LY A676, LW A676 LS A679, LY A679, LG A679 - Hyper Micro SIDELED® LS Y876, LA Y876, LO Y876, LY Y876 LT Y87S - SmartLED LW L88C, LW L88S LB L89C, LB L89S, LG L890 LS L89K, LO L89K, LY L89K LS L896, LA L896, LO L896, LY L896 - TOPLED LS T670, LO T670, LY T670, LG T670, LP T670 LSG T670, LSP T670, LSY T670, LOP T670, LYG T670 LG T671, LOG T671, LSG T671 LB T673, LV T673, LT T673, LW T673 LH T674 LS T676, LA T676, LO T676, LY T676, LB T676, LH T676, LSB T676, LW T676 LB T67C, LV T67C, LT T67C, LS T67K, LO T67K, LY T67K, LW E67C LS E67B, LA E67B, LO E67B, LY E67B, LB E67C, LV E67C, LT E67C LW T67C LS T679, LY T679, LG T679 LS T770, LO T770, LY T770, LG T770, LP T770 LB T773, LV T773, LT T773, LW T773 LH T774 LS E675, LA E675, LY E675, LS T675 LS T776, LA T776, LO T776, LY T776, LB T776 LHGB T686 LT T68C, LB T68C - Hyper Mini TOPLED® LB M676 - Mini TOPLED Santana® LG M470 LS M47K, LO M47K, LY M47K Source: http://www.osram.convergy.de LUXEON: - LUMILED® LXK2-PW12-R00, LXK2-PW12-S00, LXK2-PW14-U00, LXK2-PW14-V00 LXK2-PM12-R00, LXK2-PM12-S00, LXK2-PM14-U00 LXK2-PE12-Q00, LXK2-PE12-R00, LXK2-PE12-S00, LXK2-PE14-T00, LXK2-PE14-U00 LXK2-PB12-K00, LXK2-PB12-L00, LXK2-PB12-M00, LXK2-PB14-N00, LXK2-PB14-P00, LXK2-PB14-Q00 LXK2-PR12-L00, LXK2-PR12-M00, LXK2-PR14-Q00, LXK2-PR14-R00 LXK2-PD12-Q00, LXK2-PD12-R00, LXK2-PD12-S00 LXK2-PH12-R00, LXK2-PH12-S00 LXK2-PL12-P00, LXK2-PL12-Q00, LXK2-PL12-R00 Source: www.luxeon.com KINGBRIGHT: KA-3528ASYC Source: www.kingbright.com
Q1 = special:XTAL/S: CRYSTAL
R1-R4 = resistor:R-EU_: RESISTOR, European symbol
R5-R7 = eagle-ltspice:R: RESISTOR, European symbol; SPICEMODEL: NONE; SPICEPREFIX: R
R8 = rcl:R-EU_: RESISTOR, European symbol; SPICEPREFIX: R
SV1-SV4 = shieldLibrary:ML32: 32PIN HEADER
T1 = shieldLibrary:PHKD3NQ10T: NXP Semiconductors Dual N-Channel MOSFET
U1-U64 = shieldLibrary:UCC27531: TEXAS INSTRUMENTS Gate driver 32 V DBVR Package
U65 = shieldLibrary:LTC4365: LINEAR TECHNOLOGY Overvoltage Protector
U66 = shieldLibrary:FT232R: FT232R USB-UART Converter SSOP28 Package
X1 = shieldLibrary:MINI_USB: MINI USB SMD Connector
X2 = shieldLibrary:BNC: BNC Connector Jack 50 Ohm